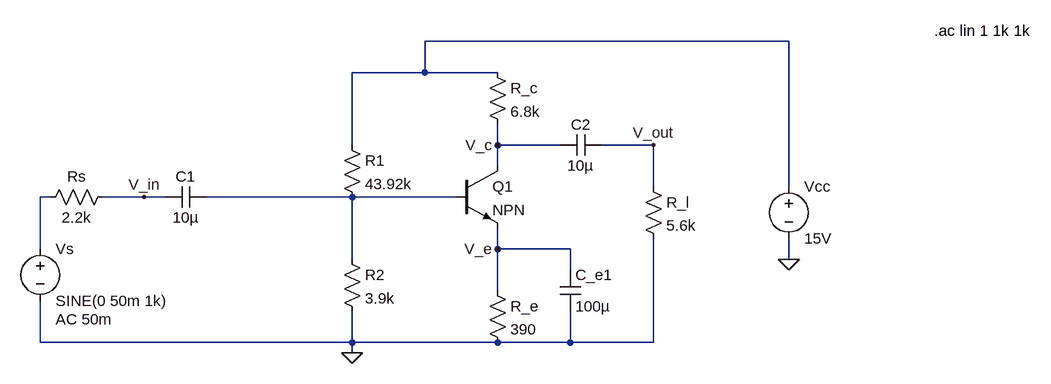
[diagram p0: schematic R_input_and_gain.asc]
R_input_and_gain.asc, the LTspice schematic file:
Version 4
SHEET 1 1232 680
WIRE 704 -80 144 -80
WIRE 144 -32 144 -80
WIRE 144 -32 32 -32
WIRE 256 -32 144 -32
WIRE 32 80 32 -32
WIRE 256 80 256 48
WIRE 352 80 256 80
WIRE 496 80 416 80
WIRE 256 112 256 80
WIRE 496 144 496 80
WIRE 704 144 704 -80
WIRE -432 160 -448 160
WIRE -288 160 -352 160
WIRE -256 160 -288 160
WIRE 32 160 -192 160
WIRE 192 160 32 160
WIRE -448 240 -448 160
WIRE 256 240 256 208
WIRE 368 240 256 240
WIRE 32 256 32 160
WIRE 704 256 704 224
WIRE 368 272 368 240
WIRE 256 304 256 240
WIRE -448 384 -448 320
WIRE 32 384 32 336
WIRE 32 384 -448 384
WIRE 256 384 32 384
WIRE 368 384 368 336
WIRE 368 384 256 384
WIRE 496 384 496 224
WIRE 496 384 368 384
WIRE 32 400 32 384
FLAG 32 400 0
FLAG 704 256 0
FLAG 256 80 V_c
FLAG 256 240 V_e
FLAG -288 160 V_in
FLAG 496 80 V_out
SYMBOL npn 192 112 R0
SYMATTR InstName Q1
SYMBOL res 240 -48 R0
SYMATTR InstName R_c
SYMATTR Value 6.8k
SYMBOL res 16 64 R0
SYMATTR InstName R1
SYMATTR Value 43.92k
SYMBOL res 16 240 R0
SYMATTR InstName R2
SYMATTR Value 3.9k
SYMBOL res 240 288 R0
SYMATTR InstName R_e
SYMATTR Value 390
SYMBOL res 480 128 R0
SYMATTR InstName R_l
SYMATTR Value 5.6k
SYMBOL res -336 144 R90
WINDOW 0 0 56 VBottom 2
WINDOW 3 32 56 VTop 2
SYMATTR InstName Rs
SYMATTR Value 2.2k
SYMBOL cap -192 144 R90
WINDOW 0 0 32 VBottom 2
WINDOW 3 32 32 VTop 2
SYMATTR InstName C1
SYMATTR Value 10µ
SYMBOL cap 352 96 R270
WINDOW 0 32 32 VTop 2
WINDOW 3 0 32 VBottom 2
SYMATTR InstName C2
SYMATTR Value 10µ
SYMBOL voltage -448 224 R0
WINDOW 123 24 124 Left 2
WINDOW 39 0 0 Left 0
SYMATTR InstName Vs
SYMATTR Value SINE(0 50m 1k)
SYMATTR Value2 AC 50m
SYMBOL voltage 704 128 R0
WINDOW 123 0 0 Left 0
WINDOW 39 0 0 Left 0
SYMATTR InstName Vcc
SYMATTR Value 15V
SYMBOL cap 352 272 R0
SYMATTR InstName C_e1
SYMATTR Value 100µ
TEXT 928 -96 Left 2 !.ac lin 1 1k 1k

The netlist it stands for:
* R_input_and_gain.asc
Q1 V_c N003 V_e 0 NPN
R_c N001 V_c 6.8k
R1 N001 N003 43.92k
R2 N003 0 3.9k
R_e V_e 0 390
R_l V_out 0 5.6k
Rs V_in N002 2.2k
C1 N003 V_in 10µ
C2 V_c V_out 10µ
Vs N002 0 SINE(0 50m 1k) AC 50m
Vcc N001 0 15V
C_e1 V_e 0 100µ
.model NPN NPN
.model PNP PNP
.lib standard.bjt
.ac lin 1 1k 1k
.backanno
.end